# Altium project 超级电容V2.1_Project.PrjPcb
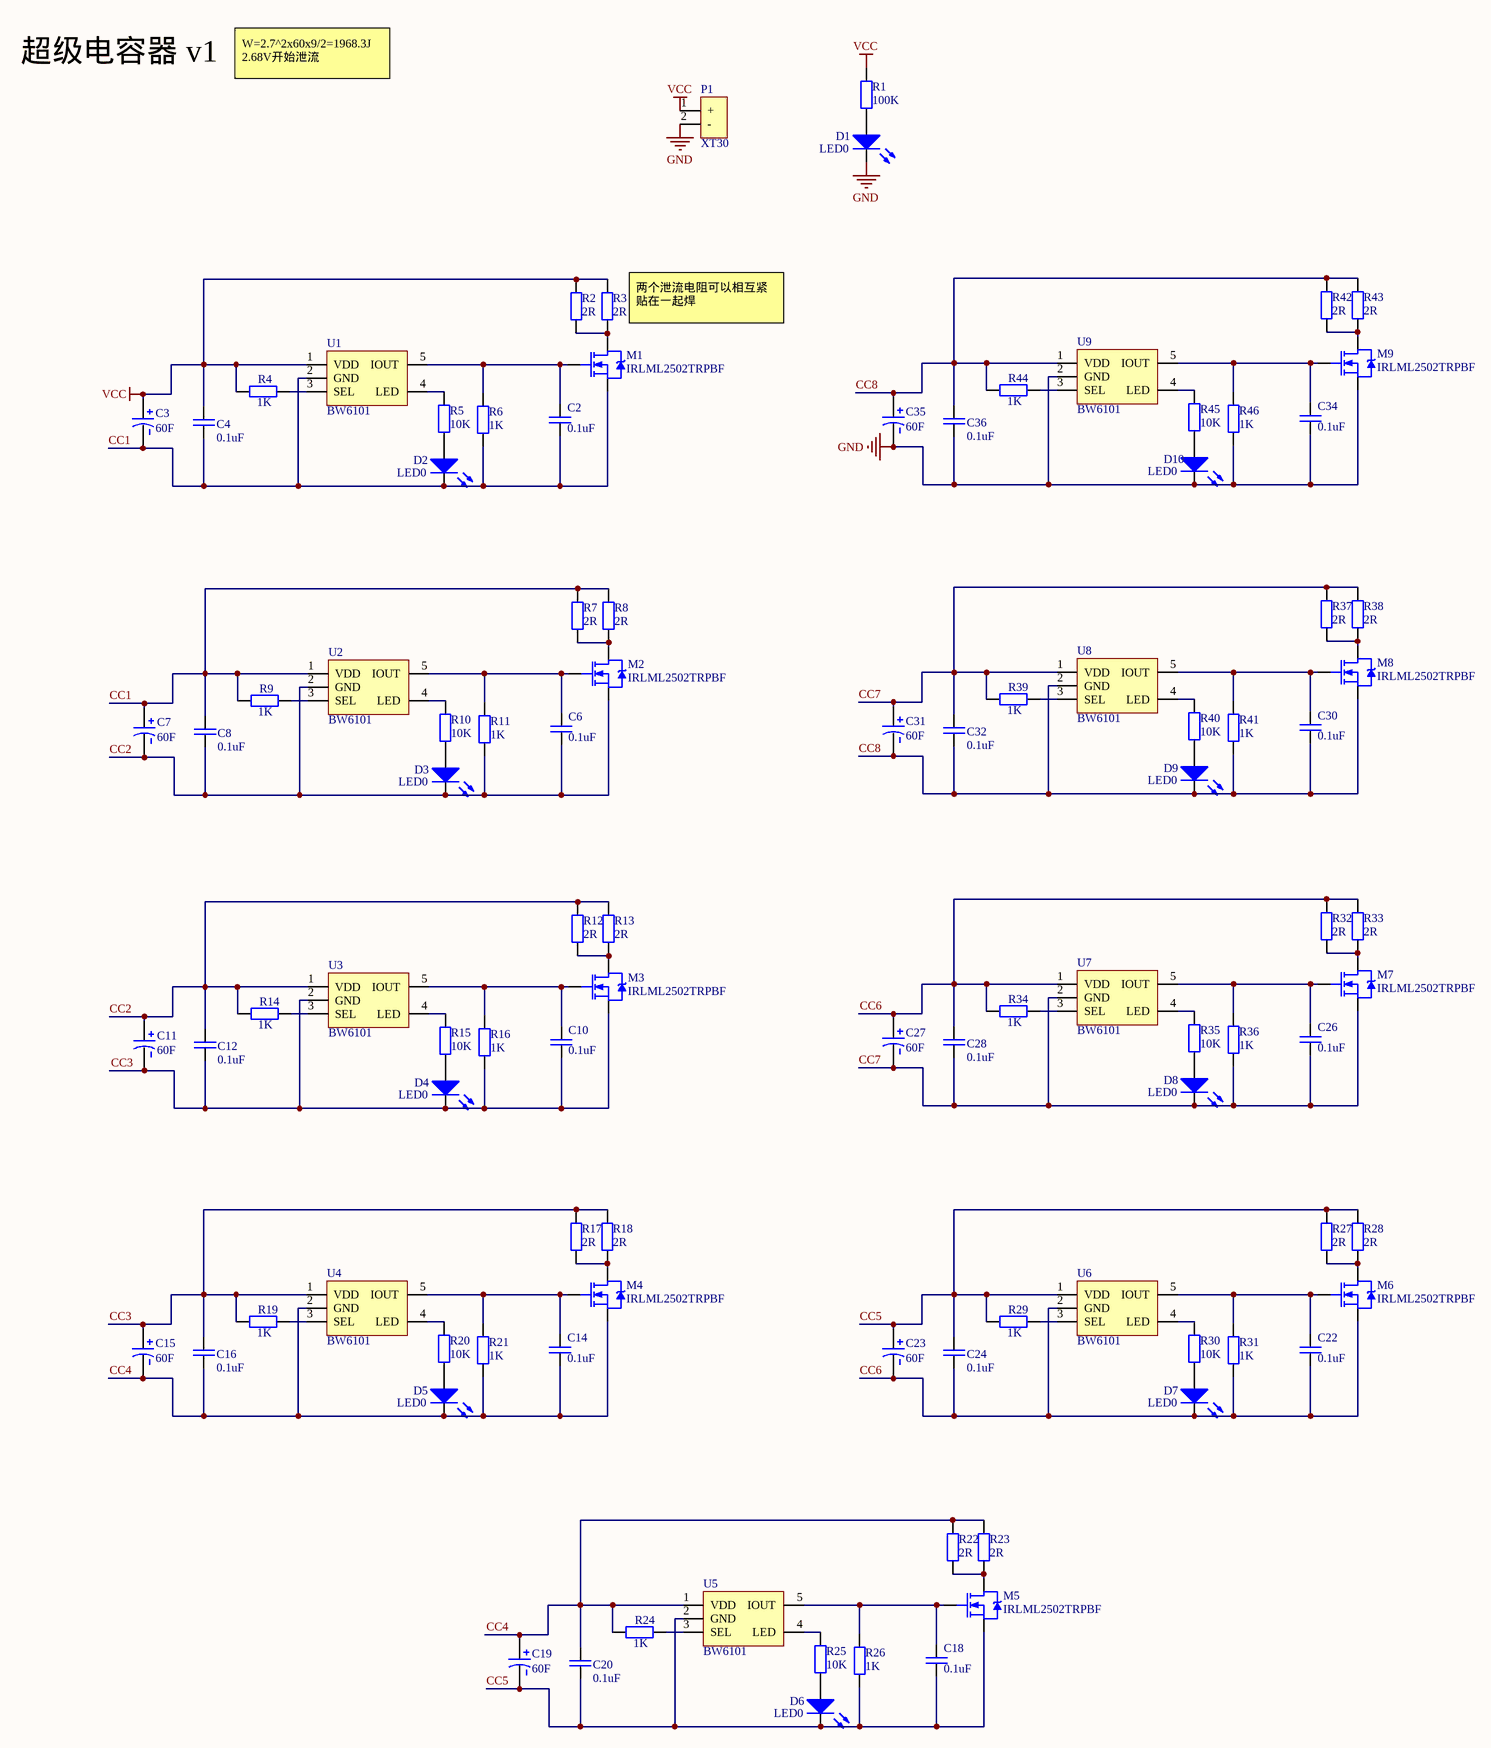
[diagram p0: Sheet.SchDoc]
1 sheet, 102 parts. Net scope: global (net labels, ports and power ports of the same name join across sheets).
Board file: PCB.PcbDoc

## Sheet Sheet.SchDoc
size D

### Parts
C2  0.1uF  [0603_C]
C3  60F  [18x40mm]
C4  0.1uF  [0603_C]
C6  0.1uF  [0603_C]
C7  60F  [18x40mm]
C8  0.1uF  [0603_C]
C10  0.1uF  [0603_C]
C11  60F  [18x40mm]
C12  0.1uF  [0603_C]
C14  0.1uF  [0603_C]
C15  60F  [18x40mm]
C16  0.1uF  [0603_C]
C18  0.1uF  [0603_C]
C19  60F  [18x40mm]
C20  0.1uF  [0603_C]
C22  0.1uF  [0603_C]
C23  60F  [18x40mm]
C24  0.1uF  [0603_C]
C26  0.1uF  [0603_C]
C27  60F  [18x40mm]
C28  0.1uF  [0603_C]
C30  0.1uF  [0603_C]
C31  60F  [18x40mm]
C32  0.1uF  [0603_C]
C34  0.1uF  [0603_C]
C35  60F  [18x40mm]
C36  0.1uF  [0603_C]
D1  LED0  [LED-0603]
D2  LED0  [LED-0603]
D3  LED0  [LED-0603]
D4  LED0  [LED-0603]
D5  LED0  [LED-0603]
D6  LED0  [LED-0603]
D7  LED0  [LED-0603]
D8  LED0  [LED-0603]
D9  LED0  [LED-0603]
D10  LED0  [LED-0603]
M1  IRLML2502TRPBF  [SOT_23 mos]
M2  IRLML2502TRPBF  [SOT_23 mos]
M3  IRLML2502TRPBF  [SOT_23 mos]
M4  IRLML2502TRPBF  [SOT_23 mos]
M5  IRLML2502TRPBF  [SOT_23 mos]
M6  IRLML2502TRPBF  [SOT_23 mos]
M7  IRLML2502TRPBF  [SOT_23 mos]
M8  IRLML2502TRPBF  [SOT_23 mos]
M9  IRLML2502TRPBF  [SOT_23 mos]
P1  XT30  [XT30-F]
R1  100K  [0603_R]
R2  2R  [2512_R]
R3  2R  [2512_R]
R4  1K  [0603_R]
R5  10K  [0603_R]
R6  1K  [0603_R]
R7  2R  [2512_R]
R8  2R  [2512_R]
R9  1K  [0603_R]
R10  10K  [0603_R]
R11  1K  [0603_R]
R12  2R  [2512_R]
R13  2R  [2512_R]
R14  1K  [0603_R]
R15  10K  [0603_R]
R16  1K  [0603_R]
R17  2R  [2512_R]
R18  2R  [2512_R]
R19  1K  [0603_R]
R20  10K  [0603_R]
R21  1K  [0603_R]
R22  2R  [2512_R]
R23  2R  [2512_R]
R24  1K  [0603_R]
R25  10K  [0603_R]
R26  1K  [0603_R]
R27  2R  [2512_R]
R28  2R  [2512_R]
R29  1K  [0603_R]
R30  10K  [0603_R]
R31  1K  [0603_R]
R32  2R  [2512_R]
R33  2R  [2512_R]
R34  1K  [0603_R]
R35  10K  [0603_R]
R36  1K  [0603_R]
R37  2R  [2512_R]
R38  2R  [2512_R]
R39  1K  [0603_R]
R40  10K  [0603_R]
R41  1K  [0603_R]
R42  2R  [2512_R]
R43  2R  [2512_R]
R44  1K  [0603_R]
R45  10K  [0603_R]
R46  1K  [0603_R]
U1  BW6101  [SOT23-5]
U2  BW6101  [SOT23-5]
U3  BW6101  [SOT23-5]
U4  BW6101  [SOT23-5]
U5  BW6101  [SOT23-5]
U6  BW6101  [SOT23-5]
U7  BW6101  [SOT23-5]
U8  BW6101  [SOT23-5]
U9  BW6101  [SOT23-5]

### Nets
GND: C34.1 C35.2 C36.1 D1.2(K) D10.2(K) M9.S P1.2(-) R46.1 U9.2(GND)
VCC: C3.1 C4.2 P1.1(+) R1.2 R2.2 R3.2 R4.2 U1.1(VDD)
CC1: C2.1 C3.2 C4.1 C7.1 C8.2 D2.2(K) M1.S R6.1 R7.2 R8.2 R9.2 U1.2(GND) U2.1(VDD)
CC2: C6.1 C7.2 C8.1 C11.1 C12.2 D3.2(K) M2.S R11.1 R12.2 R13.2 R14.2 U2.2(GND) U3.1(VDD)
CC3: C10.1 C11.2 C12.1 C15.1 C16.2 D4.2(K) M3.S R16.1 R17.2 R18.2 R19.2 U3.2(GND) U4.1(VDD)
CC4: C14.1 C15.2 C16.1 C19.1 C20.2 D5.2(K) M4.S R21.1 R22.2 R23.2 R24.2 U4.2(GND) U5.1(VDD)
CC5: C18.1 C19.2 C20.1 C23.1 C24.2 D6.2(K) M5.S R26.1 R27.2 R28.2 R29.2 U5.2(GND) U6.1(VDD)
CC6: C22.1 C23.2 C24.1 C27.1 C28.2 D7.2(K) M6.S R31.1 R32.2 R33.2 R34.2 U6.2(GND) U7.1(VDD)
CC7: C26.1 C27.2 C28.1 C31.1 C32.2 D8.2(K) M7.S R36.1 R37.2 R38.2 R39.2 U7.2(GND) U8.1(VDD)
CC8: C30.1 C31.2 C32.1 C35.1 C36.2 D9.2(K) M8.S R41.1 R42.2 R43.2 R44.2 U8.2(GND) U9.1(VDD)
NetC2_2: C2.2 M1.G R6.2 U1.5(IOUT)
NetC6_2: C6.2 M2.G R11.2 U2.5(IOUT)
NetC10_2: C10.2 M3.G R16.2 U3.5(IOUT)
NetC14_2: C14.2 M4.G R21.2 U4.5(IOUT)
NetC18_2: C18.2 M5.G R26.2 U5.5(IOUT)
NetC22_2: C22.2 M6.G R31.2 U6.5(IOUT)
NetC26_2: C26.2 M7.G R36.2 U7.5(IOUT)
NetC30_2: C30.2 M8.G R41.2 U8.5(IOUT)
NetC34_2: C34.2 M9.G R46.2 U9.5(IOUT)
NetD1_1: D1.1(A) R1.1
NetD2_1: D2.1(A) R5.1
NetD3_1: D3.1(A) R10.1
NetD4_1: D4.1(A) R15.1
NetD5_1: D5.1(A) R20.1
NetD6_1: D6.1(A) R25.1
NetD7_1: D7.1(A) R30.1
NetD8_1: D8.1(A) R35.1
NetD9_1: D9.1(A) R40.1
NetD10_1: D10.1(A) R45.1
NetM1_D: M1.D R2.1 R3.1
NetM2_D: M2.D R7.1 R8.1
NetM3_D: M3.D R12.1 R13.1
NetM4_D: M4.D R17.1 R18.1
NetM5_D: M5.D R22.1 R23.1
NetM6_D: M6.D R27.1 R28.1
NetM7_D: M7.D R32.1 R33.1
NetM8_D: M8.D R37.1 R38.1
NetM9_D: M9.D R42.1 R43.1
NetR4_1: R4.1 U1.3(SEL)
NetR5_2: R5.2 U1.4(LED)
NetR9_1: R9.1 U2.3(SEL)
NetR10_2: R10.2 U2.4(LED)
NetR14_1: R14.1 U3.3(SEL)
NetR15_2: R15.2 U3.4(LED)
NetR19_1: R19.1 U4.3(SEL)
NetR20_2: R20.2 U4.4(LED)
NetR24_1: R24.1 U5.3(SEL)
NetR25_2: R25.2 U5.4(LED)
NetR29_1: R29.1 U6.3(SEL)
NetR30_2: R30.2 U6.4(LED)
NetR34_1: R34.1 U7.3(SEL)
NetR35_2: R35.2 U7.4(LED)
NetR39_1: R39.1 U8.3(SEL)
NetR40_2: R40.2 U8.4(LED)
NetR44_1: R44.1 U9.3(SEL)
NetR45_2: R45.2 U9.4(LED)

### Notes on the sheet
- 超级电容器 v1
- W=2.7^2x60x9/2=1968.3J
  2.68V开始泄流
- 两个泄流电阻可以相互紧贴在一起焊

### Library data of the parts
C2 C4 C6 C8 C10 C12 C14 C16 C18 C20 C22 C24 C26 C28 C30 C32 C34 C36 = Cap: Published: 8-Jun-2000; LatestRevisionDate: 17-Jul-2002; LatestRevisionNote: Re-released for DXP Platform.; PackageReference: RAD-0.3; Publisher: Altium Limited
C3 C7 C11 C15 C19 C23 C27 C31 C35 = Super Cap
D1-D10 = LED0: 发光二极管; Published: 8-Jun-2000; LatestRevisionDate: 08-Jul-2005; LatestRevisionNote: Mech Layer 1 removed.; PackageReference: LED-0; Publisher: Altium Limited
M1-M9 = MOSFET
R1-R46 = Res: Published: 8-Jun-2000; LatestRevisionDate: 17-Jul-2002; LatestRevisionNote: Re-released for DXP Platform.; PackageReference: AXIAL-0.4; Publisher: Altium Limited